# EAGLE schematic untitled (EAGLE 7.5.0)
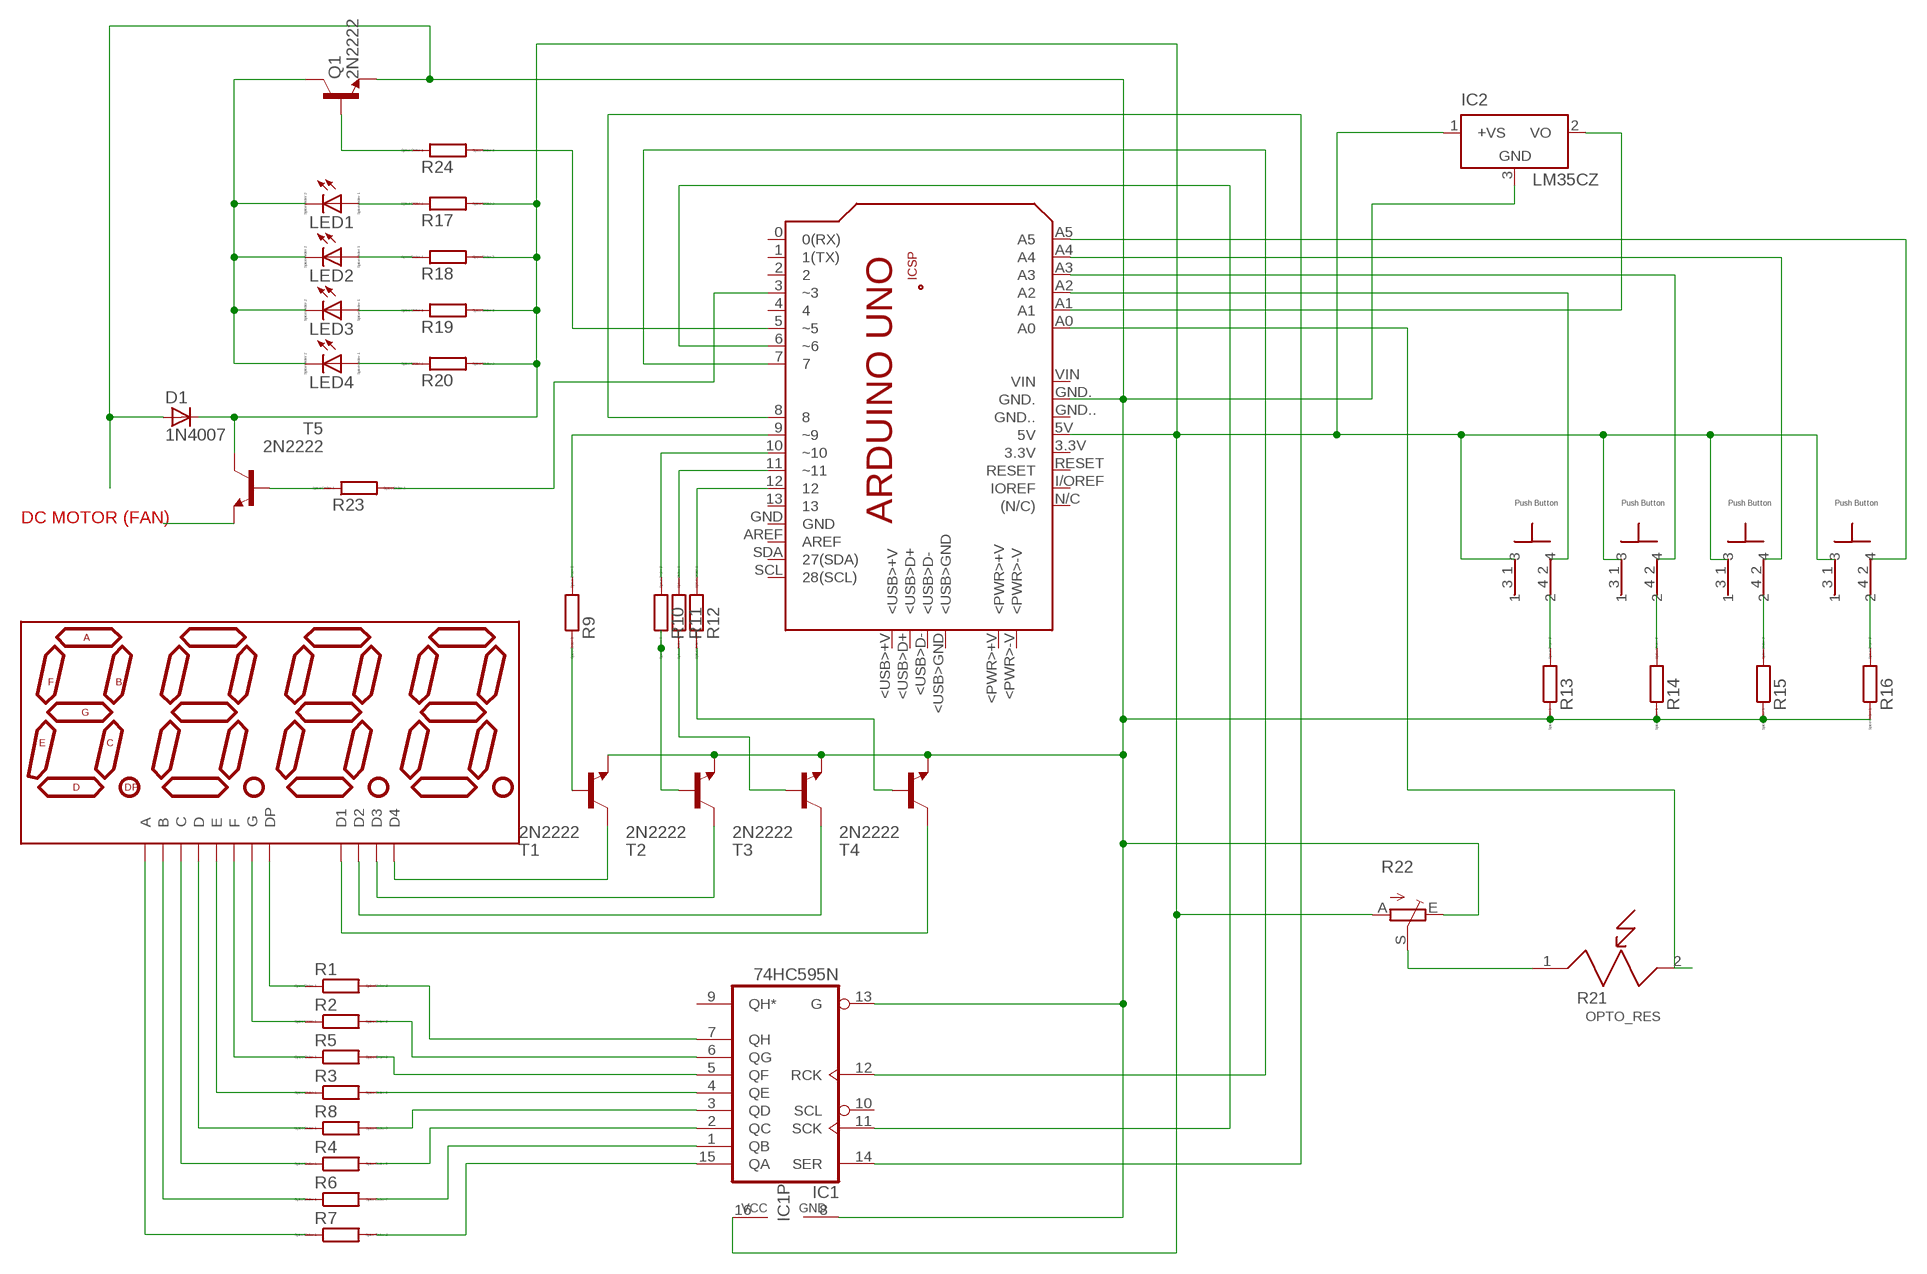
[diagram p0: schematic, sheet 1]

## Parts
D1  1N4007  [SMA]
DISP1  7-SEGMENT-4DIGIT-COUNTERPTH  [7-SEGMENT-4DIGIT-COUNTER]
IC1  74HC595N  [DIL16]
IC2  LM35CZ  [TO92]
LED1  LED_ELD260  [LED_LD260]
LED2  LED_ELD260  [LED_LD260]
LED3  LED_ELD260  [LED_LD260]
LED4  LED_ELD260  [LED_LD260]
PCB1  ARDUINO_UNO  [ARDUINO_UNO]
Q1  2N2222  [TO18]
R1  R0207/10  [0207/10]
R2  R0207/10  [0207/10]
R3  R0207/10  [0207/10]
R4  R0207/10  [0207/10]
R5  R0207/10  [0207/10]
R6  R0207/10  [0207/10]
R7  R0207/10  [0207/10]
R8  R0207/10  [0207/10]
R9  R0207/10  [0207/10]
R10  R0207/10  [0207/10]
R11  R0207/10  [0207/10]
R12  R0207/10  [0207/10]
R13  R0207/10  [0207/10]
R14  R0207/10  [0207/10]
R15  R0207/10  [0207/10]
R16  R0207/10  [0207/10]
R17  R0207/10  [0207/10]
R18  R0207/10  [0207/10]
R19  R0207/10  [0207/10]
R20  R0207/10  [0207/10]
R21  OPTO_RES  [OPTO_RES]
R22  TRIM_EU-LI10  [LI10]
R23  R0207/10  [0207/10]
R24  R0207/10  [0207/10]
T1  2N2222  [TO18]
T2  2N2222  [TO18]
T3  2N2222  [TO18]
T4  2N2222  [TO18]
T5  2N2222  [TO18]
U$1  PUSHBTN  [PUSHBTN]
U$2  PUSHBTN  [PUSHBTN]
U$3  PUSHBTN  [PUSHBTN]
U$4  PUSHBTN  [PUSHBTN]

## Nets
N$1: IC1.1(QB) R6.2
N$2: DISP1.7(B) R6.1
N$3: IC1.2(QC) R4.2
N$4: DISP1.4(C) R4.1
N$5: IC1.3(QD) R8.2
N$6: DISP1.2(D) R8.1
N$7: IC1.4(QE) R3.2
N$8: DISP1.1(E) R3.1
N$9: IC1.5(QF) R5.2
N$10: DISP1.10(F) R5.1
N$11: IC1.6(QG) R2.2
N$12: DISP1.5(G) R2.1
N$13: IC1.7(QH) R1.2
N$14: DISP1.3(DP) R1.1
N$15: IC1.15(QA) R7.2
N$16: DISP1.11(A) R7.1
N$17: DISP1.12(D1) T4.3(C)
N$18: DISP1.9(D2) T3.3(C)
N$19: DISP1.8(D3) T2.3(C)
N$20: DISP1.6(D4) T1.3(C)
N$21: PCB1.5(~5) R24.2
N$22: R12.1 T4.2(B)
N$23: R11.1 T3.2(B)
N$24: PCB1.10(~10) R10.2
N$25: PCB1.9(~9) R9.2
N$26: IC1.11(SCK) PCB1.6(~6)
N$27: D1.K(C) IC1.16(VCC) IC2.1(+VS) PCB1.5V R17.2 R18.2 R19.2 R20.2 R22.A T5.3(C) U$1.1 U$2.1 U$3.1 U$4.1
N$28: IC1.12(RCK) PCB1.7
N$29: IC1.14(SER) PCB1.8
N$30: R10.1 T2.2(B)
N$31: PCB1.11(~11) R11.2
N$32: PCB1.12 R12.2
N$33: R9.1 T1.2(B)
N$34: R13.2 U$1.4
N$35: R14.2 U$2.4
N$36: IC2.2(VO) PCB1.A1
N$37: R15.2 U$3.4
N$38: R16.2 U$4.4
N$39: D1.A IC1.8(GND) IC1.13(G) IC2.3(GND) PCB1.GND. Q1.1(E) R13.1 R14.1 R15.1 R16.1 R22.E T1.1(E) T2.1(E) T3.1(E) T4.1(E)
N$40: PCB1.A5 U$4.2
N$41: PCB1.A4 U$3.2
N$42: PCB1.A3 U$2.2
N$43: PCB1.A2 U$1.2
N$44: LED1.A R17.1
N$45: LED2.A R18.1
N$46: LED3.A R19.1
N$47: LED4.A R20.1
N$48: PCB1.3(~3) R23.2
N$49: T5.1(E)
N$50: LED1.K(C) LED2.K(C) LED3.K(C) LED4.K(C) Q1.3(C)
N$51: R23.1 T5.2(B)
N$52: Q1.2(B) R24.1
N$53: PCB1.A0 R21.2
N$54: R21.1 R22.S
Unconnected: IC1.9(QH*) IC1.10(SCL) PCB1.0(0(RX)) PCB1.1(1(TX)) PCB1.2 PCB1.3.3V PCB1.4 PCB1.13 PCB1.+5V PCB1.<PWR>+V PCB1.<PWR>-V PCB1.<USB>+V PCB1.<USB>D+ PCB1.<USB>D- PCB1.<USB>GND PCB1.AREF PCB1.GND PCB1.GND.. PCB1.GND_ PCB1.I/OREF(IOREF) PCB1.MISO PCB1.MOSI PCB1.N/C((N/C)) PCB1.RESET PCB1.RESET. PCB1.SCK PCB1.SCL(28(SCL)) PCB1.SDA(27(SDA)) PCB1.VIN U$1.3 U$2.3 U$3.3 U$4.3

## Notes on the sheet
- DC MOTOR (FAN)

## Library data of the parts
D1 = casovac:1N4007
DISP1 = SparkFun-Displays:7-SEGMENT-4DIGIT-COUNTER
IC1 = 74xx-eu:74*595: 8-bit SHIFT REGISTER, output latch
IC2 = lm35:LM35: Single-Supply Centigrade Temperature Sensor Vout = (10mV/°C x Temp °C) +5mmmV Source: http://www.national.com/ds/LM/LM35.pdf
LED1-LED4 = eagle-ltspice:LED_E: LED Source: http://www.osram.convergy.de Source: www.luxeon.com Source: www.kingbright.com; SPICEMODEL: NONE; SPICEPREFIX: D; SPICETYPE: diode
PCB1 = E14_Arduino_revB:ARDUINO_UNO: Device for representing an Arduino Uno board with a footprint in an EAGLE design. Created by Dave Young for Element14. More EAGLE documentation at: http://www.element14.com/community/community/knode/cadsoft_eagle
Q1 = gm-trans:2N2222*: NPN Transistor
R1-R20 R23 R24 = eagle-ltspice:R: RESISTOR, European symbol; SPICEMODEL: NONE; SPICEPREFIX: R
R21 = opto-resistor:OPTO_RES
R22 = pot:TRIM_EU-: POTENTIOMETER
T1-T5 = transistor:2N2222: NPN TRANSISTOR
U$1-U$4 = bens:PUSHBTN: 4-Pin Push Button Switch Pins 1+3 are interconnected Pins 2+4 are interconnected